# EAGLE design BLOCKS (EAGLE 9.6.2)
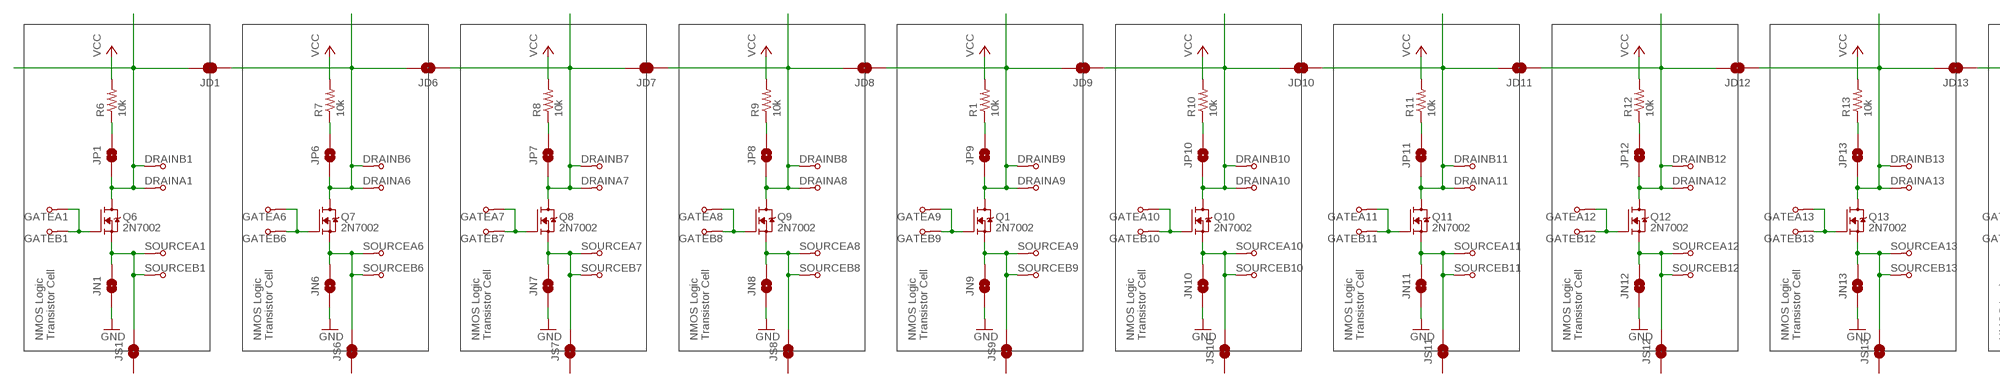
[diagram p0: schematic, sheet 1, part 1 of 2]
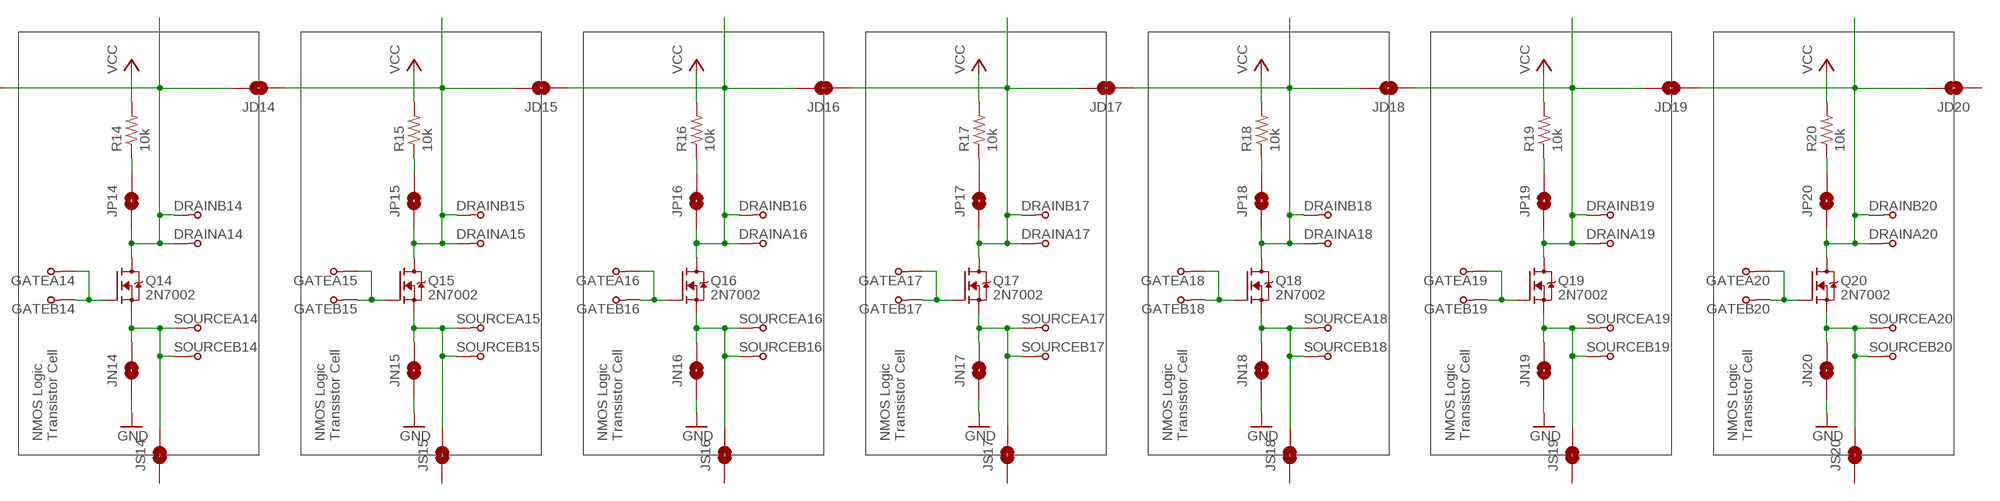
[diagram p1: schematic, sheet 1, part 2 of 2]

## Parts
DRAINA1  TPTHT  [PROTOPAD-THT-PAD]
DRAINA6  TPTHT  [PROTOPAD-THT-PAD]
DRAINA7  TPTHT  [PROTOPAD-THT-PAD]
DRAINA8  TPTHT  [PROTOPAD-THT-PAD]
DRAINA9  TPTHT  [PROTOPAD-THT-PAD]
DRAINA10  TPTHT  [PROTOPAD-THT-PAD]
DRAINA11  TPTHT  [PROTOPAD-THT-PAD]
DRAINA12  TPTHT  [PROTOPAD-THT-PAD]
DRAINA13  TPTHT  [PROTOPAD-THT-PAD]
DRAINA14  TPTHT  [PROTOPAD-THT-PAD]
DRAINA15  TPTHT  [PROTOPAD-THT-PAD]
DRAINA16  TPTHT  [PROTOPAD-THT-PAD]
DRAINA17  TPTHT  [PROTOPAD-THT-PAD]
DRAINA18  TPTHT  [PROTOPAD-THT-PAD]
DRAINA19  TPTHT  [PROTOPAD-THT-PAD]
DRAINA20  TPTHT  [PROTOPAD-THT-PAD]
DRAINB1  TPTHT  [PROTOPAD-THT-PAD]
DRAINB6  TPTHT  [PROTOPAD-THT-PAD]
DRAINB7  TPTHT  [PROTOPAD-THT-PAD]
DRAINB8  TPTHT  [PROTOPAD-THT-PAD]
DRAINB9  TPTHT  [PROTOPAD-THT-PAD]
DRAINB10  TPTHT  [PROTOPAD-THT-PAD]
DRAINB11  TPTHT  [PROTOPAD-THT-PAD]
DRAINB12  TPTHT  [PROTOPAD-THT-PAD]
DRAINB13  TPTHT  [PROTOPAD-THT-PAD]
DRAINB14  TPTHT  [PROTOPAD-THT-PAD]
DRAINB15  TPTHT  [PROTOPAD-THT-PAD]
DRAINB16  TPTHT  [PROTOPAD-THT-PAD]
DRAINB17  TPTHT  [PROTOPAD-THT-PAD]
DRAINB18  TPTHT  [PROTOPAD-THT-PAD]
DRAINB19  TPTHT  [PROTOPAD-THT-PAD]
DRAINB20  TPTHT  [PROTOPAD-THT-PAD]
GATEA1  TPTHT  [PROTOPAD-THT-PAD]
GATEA6  TPTHT  [PROTOPAD-THT-PAD]
GATEA7  TPTHT  [PROTOPAD-THT-PAD]
GATEA8  TPTHT  [PROTOPAD-THT-PAD]
GATEA9  TPTHT  [PROTOPAD-THT-PAD]
GATEA10  TPTHT  [PROTOPAD-THT-PAD]
GATEA11  TPTHT  [PROTOPAD-THT-PAD]
GATEA12  TPTHT  [PROTOPAD-THT-PAD]
GATEA13  TPTHT  [PROTOPAD-THT-PAD]
GATEA14  TPTHT  [PROTOPAD-THT-PAD]
GATEA15  TPTHT  [PROTOPAD-THT-PAD]
GATEA16  TPTHT  [PROTOPAD-THT-PAD]
GATEA17  TPTHT  [PROTOPAD-THT-PAD]
GATEA18  TPTHT  [PROTOPAD-THT-PAD]
GATEA19  TPTHT  [PROTOPAD-THT-PAD]
GATEA20  TPTHT  [PROTOPAD-THT-PAD]
GATEB1  TPTHT  [PROTOPAD-THT-PAD]
GATEB6  TPTHT  [PROTOPAD-THT-PAD]
GATEB7  TPTHT  [PROTOPAD-THT-PAD]
GATEB8  TPTHT  [PROTOPAD-THT-PAD]
GATEB9  TPTHT  [PROTOPAD-THT-PAD]
GATEB10  TPTHT  [PROTOPAD-THT-PAD]
GATEB11  TPTHT  [PROTOPAD-THT-PAD]
GATEB12  TPTHT  [PROTOPAD-THT-PAD]
GATEB13  TPTHT  [PROTOPAD-THT-PAD]
GATEB14  TPTHT  [PROTOPAD-THT-PAD]
GATEB15  TPTHT  [PROTOPAD-THT-PAD]
GATEB16  TPTHT  [PROTOPAD-THT-PAD]
GATEB17  TPTHT  [PROTOPAD-THT-PAD]
GATEB18  TPTHT  [PROTOPAD-THT-PAD]
GATEB19  TPTHT  [PROTOPAD-THT-PAD]
GATEB20  TPTHT  [PROTOPAD-THT-PAD]
JD1  SJ_NO_THIN  [SJ_2S-NO-THIN]
JD6  SJ_NO_THIN  [SJ_2S-NO-THIN]
JD7  SJ_NO_THIN  [SJ_2S-NO-THIN]
JD8  SJ_NO_THIN  [SJ_2S-NO-THIN]
JD9  SJ_NO_THIN  [SJ_2S-NO-THIN]
JD10  SJ_NO_THIN  [SJ_2S-NO-THIN]
JD11  SJ_NO_THIN  [SJ_2S-NO-THIN]
JD12  SJ_NO_THIN  [SJ_2S-NO-THIN]
JD13  SJ_NO_THIN  [SJ_2S-NO-THIN]
JD14  SJ_NO_THIN  [SJ_2S-NO-THIN]
JD15  SJ_NO_THIN  [SJ_2S-NO-THIN]
JD16  SJ_NO_THIN  [SJ_2S-NO-THIN]
JD17  SJ_NO_THIN  [SJ_2S-NO-THIN]
JD18  SJ_NO_THIN  [SJ_2S-NO-THIN]
JD19  SJ_NO_THIN  [SJ_2S-NO-THIN]
JD20  SJ_NO_THIN  [SJ_2S-NO-THIN]
JN1  SJ_NO_THIN  [SJ_2S-NO-THIN]
JN6  SJ_NO_THIN  [SJ_2S-NO-THIN]
JN7  SJ_NO_THIN  [SJ_2S-NO-THIN]
JN8  SJ_NO_THIN  [SJ_2S-NO-THIN]
JN9  SJ_NO_THIN  [SJ_2S-NO-THIN]
JN10  SJ_NO_THIN  [SJ_2S-NO-THIN]
JN11  SJ_NO_THIN  [SJ_2S-NO-THIN]
JN12  SJ_NO_THIN  [SJ_2S-NO-THIN]
JN13  SJ_NO_THIN  [SJ_2S-NO-THIN]
JN14  SJ_NO_THIN  [SJ_2S-NO-THIN]
JN15  SJ_NO_THIN  [SJ_2S-NO-THIN]
JN16  SJ_NO_THIN  [SJ_2S-NO-THIN]
JN17  SJ_NO_THIN  [SJ_2S-NO-THIN]
JN18  SJ_NO_THIN  [SJ_2S-NO-THIN]
JN19  SJ_NO_THIN  [SJ_2S-NO-THIN]
JN20  SJ_NO_THIN  [SJ_2S-NO-THIN]
JP1  SJ_NO_THIN  [SJ_2S-NO-THIN]
JP6  SJ_NO_THIN  [SJ_2S-NO-THIN]
JP7  SJ_NO_THIN  [SJ_2S-NO-THIN]
JP8  SJ_NO_THIN  [SJ_2S-NO-THIN]
JP9  SJ_NO_THIN  [SJ_2S-NO-THIN]
JP10  SJ_NO_THIN  [SJ_2S-NO-THIN]
JP11  SJ_NO_THIN  [SJ_2S-NO-THIN]
JP12  SJ_NO_THIN  [SJ_2S-NO-THIN]
JP13  SJ_NO_THIN  [SJ_2S-NO-THIN]
JP14  SJ_NO_THIN  [SJ_2S-NO-THIN]
JP15  SJ_NO_THIN  [SJ_2S-NO-THIN]
JP16  SJ_NO_THIN  [SJ_2S-NO-THIN]
JP17  SJ_NO_THIN  [SJ_2S-NO-THIN]
JP18  SJ_NO_THIN  [SJ_2S-NO-THIN]
JP19  SJ_NO_THIN  [SJ_2S-NO-THIN]
JP20  SJ_NO_THIN  [SJ_2S-NO-THIN]
JS1  SJ_NO_THIN  [SJ_2S-NO-THIN]
JS6  SJ_NO_THIN  [SJ_2S-NO-THIN]
JS7  SJ_NO_THIN  [SJ_2S-NO-THIN]
JS8  SJ_NO_THIN  [SJ_2S-NO-THIN]
JS9  SJ_NO_THIN  [SJ_2S-NO-THIN]
JS10  SJ_NO_THIN  [SJ_2S-NO-THIN]
JS11  SJ_NO_THIN  [SJ_2S-NO-THIN]
JS12  SJ_NO_THIN  [SJ_2S-NO-THIN]
JS13  SJ_NO_THIN  [SJ_2S-NO-THIN]
JS14  SJ_NO_THIN  [SJ_2S-NO-THIN]
JS15  SJ_NO_THIN  [SJ_2S-NO-THIN]
JS16  SJ_NO_THIN  [SJ_2S-NO-THIN]
JS17  SJ_NO_THIN  [SJ_2S-NO-THIN]
JS18  SJ_NO_THIN  [SJ_2S-NO-THIN]
JS19  SJ_NO_THIN  [SJ_2S-NO-THIN]
JS20  SJ_NO_THIN  [SJ_2S-NO-THIN]
Q1  2N7002  [SOT23]
Q6  2N7002  [SOT23]
Q7  2N7002  [SOT23]
Q8  2N7002  [SOT23]
Q9  2N7002  [SOT23]
Q10  2N7002  [SOT23]
Q11  2N7002  [SOT23]
Q12  2N7002  [SOT23]
Q13  2N7002  [SOT23]
Q14  2N7002  [SOT23]
Q15  2N7002  [SOT23]
Q16  2N7002  [SOT23]
Q17  2N7002  [SOT23]
Q18  2N7002  [SOT23]
Q19  2N7002  [SOT23]
Q20  2N7002  [SOT23]
R1  10k  RES0603  [R0603]
R6  10k  RES0603  [R0603]
R7  10k  RES0603  [R0603]
R8  10k  RES0603  [R0603]
R9  10k  RES0603  [R0603]
R10  10k  RES0603  [R0603]
R11  10k  RES0603  [R0603]
R12  10k  RES0603  [R0603]
R13  10k  RES0603  [R0603]
R14  10k  RES0603  [R0603]
R15  10k  RES0603  [R0603]
R16  10k  RES0603  [R0603]
R17  10k  RES0603  [R0603]
R18  10k  RES0603  [R0603]
R19  10k  RES0603  [R0603]
R20  10k  RES0603  [R0603]
SOURCEA1  TPTHT  [PROTOPAD-THT-PAD]
SOURCEA6  TPTHT  [PROTOPAD-THT-PAD]
SOURCEA7  TPTHT  [PROTOPAD-THT-PAD]
SOURCEA8  TPTHT  [PROTOPAD-THT-PAD]
SOURCEA9  TPTHT  [PROTOPAD-THT-PAD]
SOURCEA10  TPTHT  [PROTOPAD-THT-PAD]
SOURCEA11  TPTHT  [PROTOPAD-THT-PAD]
SOURCEA12  TPTHT  [PROTOPAD-THT-PAD]
SOURCEA13  TPTHT  [PROTOPAD-THT-PAD]
SOURCEA14  TPTHT  [PROTOPAD-THT-PAD]
SOURCEA15  TPTHT  [PROTOPAD-THT-PAD]
SOURCEA16  TPTHT  [PROTOPAD-THT-PAD]
SOURCEA17  TPTHT  [PROTOPAD-THT-PAD]
SOURCEA18  TPTHT  [PROTOPAD-THT-PAD]
SOURCEA19  TPTHT  [PROTOPAD-THT-PAD]
SOURCEA20  TPTHT  [PROTOPAD-THT-PAD]
SOURCEB1  TPTHT  [PROTOPAD-THT-PAD]
SOURCEB6  TPTHT  [PROTOPAD-THT-PAD]
SOURCEB7  TPTHT  [PROTOPAD-THT-PAD]
SOURCEB8  TPTHT  [PROTOPAD-THT-PAD]
SOURCEB9  TPTHT  [PROTOPAD-THT-PAD]
SOURCEB10  TPTHT  [PROTOPAD-THT-PAD]
SOURCEB11  TPTHT  [PROTOPAD-THT-PAD]
SOURCEB12  TPTHT  [PROTOPAD-THT-PAD]
SOURCEB13  TPTHT  [PROTOPAD-THT-PAD]
SOURCEB14  TPTHT  [PROTOPAD-THT-PAD]
SOURCEB15  TPTHT  [PROTOPAD-THT-PAD]
SOURCEB16  TPTHT  [PROTOPAD-THT-PAD]
SOURCEB17  TPTHT  [PROTOPAD-THT-PAD]
SOURCEB18  TPTHT  [PROTOPAD-THT-PAD]
SOURCEB19  TPTHT  [PROTOPAD-THT-PAD]
SOURCEB20  TPTHT  [PROTOPAD-THT-PAD]

## Nets
GND: JN1.1 JN6.1 JN7.1 JN8.1 JN9.1 JN10.1 JN11.1 JN12.1 JN13.1 JN14.1 JN15.1 JN16.1 JN17.1 JN18.1 JN19.1 JN20.1
N$1: JP9.2 R1.1
N$2: JN9.2 JS9.2 Q1.2(S) SOURCEA9.P1(S) SOURCEB9.P1(S)
N$5: DRAINA9.P1(S) DRAINB9.P1(S) JD8.1 JD9.2 JP9.1 Q1.3(D)
N$7: JP1.2 R6.1
N$21: JN1.2 JS1.2 Q6.2(S) SOURCEA1.P1(S) SOURCEB1.P1(S)
N$22: DRAINA1.P1(S) DRAINB1.P1(S) JD1.2 JP1.1 Q6.3(D)
N$23: GATEA1.P1(S) GATEB1.P1(S) Q6.1(G)
N$24: JP6.2 R7.1
N$25: JN6.2 JS6.2 Q7.2(S) SOURCEA6.P1(S) SOURCEB6.P1(S)
N$26: DRAINA6.P1(S) DRAINB6.P1(S) JD1.1 JD6.2 JP6.1 Q7.3(D)
N$27: GATEA6.P1(S) GATEB6.P1(S) Q7.1(G)
N$28: JP7.2 R8.1
N$29: JN7.2 JS7.2 Q8.2(S) SOURCEA7.P1(S) SOURCEB7.P1(S)
N$30: DRAINA7.P1(S) DRAINB7.P1(S) JD6.1 JD7.2 JP7.1 Q8.3(D)
N$31: GATEA7.P1(S) GATEB7.P1(S) Q8.1(G)
N$32: JP8.2 R9.1
N$33: JN8.2 JS8.2 Q9.2(S) SOURCEA8.P1(S) SOURCEB8.P1(S)
N$34: DRAINA8.P1(S) DRAINB8.P1(S) JD7.1 JD8.2 JP8.1 Q9.3(D)
N$35: GATEA8.P1(S) GATEB8.P1(S) Q9.1(G)
N$36: GATEA9.P1(S) GATEB9.P1(S) Q1.1(G)
N$37: JP10.2 R10.1
N$38: JN10.2 JS10.2 Q10.2(S) SOURCEA10.P1(S) SOURCEB10.P1(S)
N$39: DRAINA10.P1(S) DRAINB10.P1(S) JD9.1 JD10.2 JP10.1 Q10.3(D)
N$40: GATEA10.P1(S) GATEB10.P1(S) Q10.1(G)
N$41: JP11.2 R11.1
N$42: JN11.2 JS11.2 Q11.2(S) SOURCEA11.P1(S) SOURCEB11.P1(S)
N$43: DRAINA11.P1(S) DRAINB11.P1(S) JD10.1 JD11.2 JP11.1 Q11.3(D)
N$44: GATEA11.P1(S) GATEB11.P1(S) Q11.1(G)
N$45: JP12.2 R12.1
N$46: JN12.2 JS12.2 Q12.2(S) SOURCEA12.P1(S) SOURCEB12.P1(S)
N$47: DRAINA12.P1(S) DRAINB12.P1(S) JD11.1 JD12.2 JP12.1 Q12.3(D)
N$48: GATEA12.P1(S) GATEB12.P1(S) Q12.1(G)
N$49: JP13.2 R13.1
N$50: JN13.2 JS13.2 Q13.2(S) SOURCEA13.P1(S) SOURCEB13.P1(S)
N$51: DRAINA13.P1(S) DRAINB13.P1(S) JD12.1 JD13.2 JP13.1 Q13.3(D)
N$52: GATEA13.P1(S) GATEB13.P1(S) Q13.1(G)
N$53: JP14.2 R14.1
N$54: JN14.2 JS14.2 Q14.2(S) SOURCEA14.P1(S) SOURCEB14.P1(S)
N$55: DRAINA14.P1(S) DRAINB14.P1(S) JD13.1 JD14.2 JP14.1 Q14.3(D)
N$56: GATEA14.P1(S) GATEB14.P1(S) Q14.1(G)
N$57: JP15.2 R15.1
N$58: JN15.2 JS15.2 Q15.2(S) SOURCEA15.P1(S) SOURCEB15.P1(S)
N$59: DRAINA15.P1(S) DRAINB15.P1(S) JD14.1 JD15.2 JP15.1 Q15.3(D)
N$60: GATEA15.P1(S) GATEB15.P1(S) Q15.1(G)
N$61: JP16.2 R16.1
N$62: JN16.2 JS16.2 Q16.2(S) SOURCEA16.P1(S) SOURCEB16.P1(S)
N$63: DRAINA16.P1(S) DRAINB16.P1(S) JD15.1 JD16.2 JP16.1 Q16.3(D)
N$64: GATEA16.P1(S) GATEB16.P1(S) Q16.1(G)
N$65: JP17.2 R17.1
N$66: JN17.2 JS17.2 Q17.2(S) SOURCEA17.P1(S) SOURCEB17.P1(S)
N$67: DRAINA17.P1(S) DRAINB17.P1(S) JD16.1 JD17.2 JP17.1 Q17.3(D)
N$68: GATEA17.P1(S) GATEB17.P1(S) Q17.1(G)
N$69: JP18.2 R18.1
N$70: JN18.2 JS18.2 Q18.2(S) SOURCEA18.P1(S) SOURCEB18.P1(S)
N$71: DRAINA18.P1(S) DRAINB18.P1(S) JD17.1 JD18.2 JP18.1 Q18.3(D)
N$72: GATEA18.P1(S) GATEB18.P1(S) Q18.1(G)
N$73: JP19.2 R19.1
N$74: JN19.2 JS19.2 Q19.2(S) SOURCEA19.P1(S) SOURCEB19.P1(S)
N$75: DRAINA19.P1(S) DRAINB19.P1(S) JD18.1 JD19.2 JP19.1 Q19.3(D)
N$76: GATEA19.P1(S) GATEB19.P1(S) Q19.1(G)
N$77: JP20.2 R20.1
N$78: JN20.2 JS20.2 Q20.2(S) SOURCEA20.P1(S) SOURCEB20.P1(S)
N$79: DRAINA20.P1(S) DRAINB20.P1(S) JD19.1 JD20.2 JP20.1 Q20.3(D)
N$80: GATEA20.P1(S) GATEB20.P1(S) Q20.1(G)
VCC: R1.2 R6.2 R7.2 R8.2 R9.2 R10.2 R11.2 R12.2 R13.2 R14.2 R15.2 R16.2 R17.2 R18.2 R19.2 R20.2
Unconnected: JD20.1 JS1.1 JS6.1 JS7.1 JS8.1 JS9.1 JS10.1 JS11.1 JS12.1 JS13.1 JS14.1 JS15.1 JS16.1 JS17.1 JS18.1 JS19.1 JS20.1

## Notes on the sheet
- NMOS Logic
  Transistor Cell
- NMOS Logic
  Transistor Cell
- NMOS Logic
  Transistor Cell
- NMOS Logic
  Transistor Cell
- NMOS Logic
  Transistor Cell
- NMOS Logic
  Transistor Cell
- NMOS Logic
  Transistor Cell
- NMOS Logic
  Transistor Cell
- NMOS Logic
  Transistor Cell
- NMOS Logic
  Transistor Cell
- NMOS Logic
  Transistor Cell
- NMOS Logic
  Transistor Cell
- NMOS Logic
  Transistor Cell
- NMOS Logic
  Transistor Cell
- NMOS Logic
  Transistor Cell
- NMOS Logic
  Transistor Cell

## Library data of the parts
DRAINA1 DRAINA6-DRAINA20 DRAINB1 DRAINB6-DRAINB20 GATEA1 GATEA6-GATEA20 GATEB1 GATEB6-GATEB20 SOURCEA1 SOURCEA6-SOURCEA20 SOURCEB1 SOURCEB6-SOURCEB20 = ellajameson-core:TP
JD1 JD6-JD20 JN1 JN6-JN20 JP1 JP6-JP20 JS1 JS6-JS20 = ellajameson-core:SJ: Solder Jumper Standard SMD solder jumper. Used to automate production. Two varients : Normally Open and Normally Closed are the same, but have different paste layers. NC will have a large amount of paste and should jumper during reflow.
Q1 Q6-Q20 = ellajameson-core:2N7002
R1 R6-R20 = ellajameson-core:RES

## Board
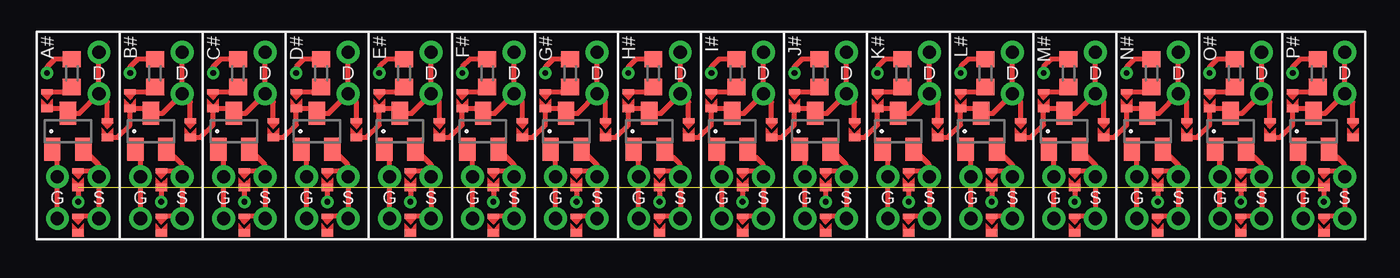
[diagram p2: board, top side]
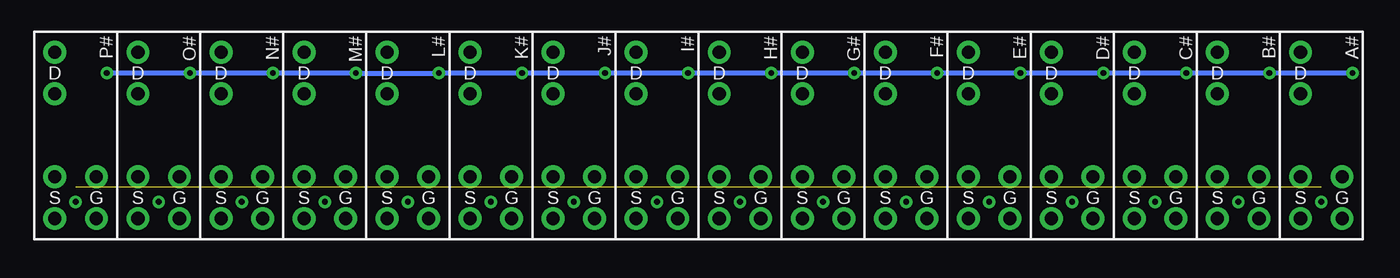
[diagram p3: board, bottom side, seen from below]

No outline drawn. Coordinates in mm, seen from the top.
Copper layers (1*16): Top 0.035mm / dielectric 1.5mm / Bottom 0.035mm
Design rules "default": minimum track width 6mil, minimum drill 0.35mm, track to track 6mil, track to pad 6mil, pad to pad 6mil, via to via 6mil, smd to smd 6mil, copper to edge 40mil, drill to drill 6mil, minimum pad ring 10mil, minimum via ring 8mil, stop-mask expansion 4mil, vias tented up to drill 0mil, thermal gap 10mil

### Footprints (pad centres in the part's own frame; a part is rotated, then mirrored left to right if it is on the bottom)
PROTOPAD-THT-PAD = drill 0.8 pad 1.4: P1 0,0
SJ_2S-NO-THIN = smd 0.45 x 0.7: 1 -0.508,0 | smd 0.3 x 0.7: 2 0.508,0
SOT23 = smd 1 x 1.4: 1 -0.95,-1.1; 2 0.95,-1.1; 3 0,1.1
R0603 = smd 1 x 1.1: 1 -0.85,0; 2 0.85,0

### Placement (x,y rotation side)
DRAINA1  3.81,11.43 0 top
DRAINA6  8.89,11.43 0 top
DRAINA7  13.97,11.43 0 top
DRAINA8  19.05,11.43 0 top
DRAINA9  24.13,11.43 0 top
DRAINA10  29.21,11.43 0 top
DRAINA11  34.29,11.43 0 top
DRAINA12  39.37,11.43 0 top
DRAINA13  44.45,11.43 0 top
DRAINA14  49.53,11.43 0 top
DRAINA15  54.61,11.43 0 top
DRAINA16  59.69,11.43 0 top
DRAINA17  64.77,11.43 0 top
DRAINA18  69.85,11.43 0 top
DRAINA19  74.93,11.43 0 top
DRAINA20  80.01,11.43 0 top
DRAINB1  3.81,8.89 0 top
DRAINB6  8.89,8.89 0 top
DRAINB7  13.97,8.89 0 top
DRAINB8  19.05,8.89 0 top
DRAINB9  24.13,8.89 0 top
DRAINB10  29.21,8.89 0 top
DRAINB11  34.29,8.89 0 top
DRAINB12  39.37,8.89 0 top
DRAINB13  44.45,8.89 0 top
DRAINB14  49.53,8.89 0 top
DRAINB15  54.61,8.89 0 top
DRAINB16  59.69,8.89 0 top
DRAINB17  64.77,8.89 0 top
DRAINB18  69.85,8.89 0 top
DRAINB19  74.93,8.89 0 top
DRAINB20  80.01,8.89 0 top
GATEA1  1.27,3.81 0 top
GATEA6  6.35,3.81 0 top
GATEA7  11.43,3.81 0 top
GATEA8  16.51,3.81 0 top
GATEA9  21.59,3.81 0 top
GATEA10  26.67,3.81 0 top
GATEA11  31.75,3.81 0 top
GATEA12  36.83,3.81 0 top
GATEA13  41.91,3.81 0 top
GATEA14  46.99,3.81 0 top
GATEA15  52.07,3.81 0 top
GATEA16  57.15,3.81 0 top
GATEA17  62.23,3.81 0 top
GATEA18  67.31,3.81 0 top
GATEA19  72.39,3.81 0 top
GATEA20  77.47,3.81 0 top
GATEB1  1.27,1.27 0 top
GATEB6  6.35,1.27 0 top
GATEB7  11.43,1.27 0 top
GATEB8  16.51,1.27 0 top
GATEB9  21.59,1.27 0 top
GATEB10  26.67,1.27 0 top
GATEB11  31.75,1.27 0 top
GATEB12  36.83,1.27 0 top
GATEB13  41.91,1.27 0 top
GATEB14  46.99,1.27 0 top
GATEB15  52.07,1.27 0 top
GATEB16  57.15,1.27 0 top
GATEB17  62.23,1.27 0 top
GATEB18  67.31,1.27 0 top
GATEB19  72.39,1.27 0 top
GATEB20  77.47,1.27 0 top
JD1  4.32,6.73 90 top
JD6  9.4,6.73 90 top
JD7  14.48,6.73 90 top
JD8  19.56,6.73 90 top
JD9  24.64,6.73 90 top
JD10  29.72,6.73 90 top
JD11  34.8,6.73 90 top
JD12  39.88,6.73 90 top
JD13  44.96,6.73 90 top
JD14  50.04,6.73 90 top
JD15  55.12,6.73 90 top
JD16  60.2,6.73 90 top
JD17  65.28,6.73 90 top
JD18  70.36,6.73 90 top
JD19  75.44,6.73 90 top
JD20  80.52,6.73 90 top
JN1  2.54,3.68 90 top
JN6  7.62,3.68 90 top
JN7  12.7,3.68 90 top
JN8  17.78,3.68 90 top
JN9  22.86,3.68 90 top
JN10  27.94,3.68 90 top
JN11  33.02,3.68 90 top
JN12  38.1,3.68 90 top
JN13  43.18,3.68 90 top
JN14  48.26,3.68 90 top
JN15  53.34,3.68 90 top
JN16  58.42,3.68 90 top
JN17  63.5,3.68 90 top
JN18  68.58,3.68 90 top
JN19  73.66,3.68 90 top
JN20  78.74,3.68 90 top
JP1  0.64,8.51 90 top
JP6  5.71,8.51 90 top
JP7  10.79,8.51 90 top
JP8  15.88,8.51 90 top
JP9  20.95,8.51 90 top
JP10  26.04,8.51 90 top
JP11  31.11,8.51 90 top
JP12  36.2,8.51 90 top
JP13  41.27,8.51 90 top
JP14  46.35,8.51 90 top
JP15  51.44,8.51 90 top
JP16  56.52,8.51 90 top
JP17  61.59,8.51 90 top
JP18  66.67,8.51 90 top
JP19  71.75,8.51 90 top
JP20  76.83,8.51 90 top
JS1  2.54,0.89 90 top
JS6  7.62,0.89 90 top
JS7  12.7,0.89 90 top
JS8  17.78,0.89 90 top
JS9  22.86,0.89 90 top
JS10  27.94,0.89 90 top
JS11  33.02,0.89 90 top
JS12  38.1,0.89 90 top
JS13  43.18,0.89 90 top
JS14  48.26,0.89 90 top
JS15  53.34,0.89 90 top
JS16  58.42,0.89 90 top
JS17  63.5,0.89 90 top
JS18  68.58,0.89 90 top
JS19  73.66,0.89 90 top
JS20  78.74,0.89 90 top
Q1  22.23,6.6 0 top
Q6  1.91,6.6 0 top
Q7  6.99,6.6 0 top
Q8  12.06,6.6 0 top
Q9  17.14,6.6 0 top
Q10  27.3,6.6 0 top
Q11  32.38,6.6 0 top
Q12  37.47,6.6 0 top
Q13  42.55,6.6 0 top
Q14  47.62,6.6 0 top
Q15  52.7,6.6 0 top
Q16  57.78,6.6 0 top
Q17  62.87,6.6 0 top
Q18  67.94,6.6 0 top
Q19  73.03,6.6 0 top
Q20  78.11,6.6 0 top
R1  22.48,10.16 90 top
R6  2.16,10.16 90 top
R7  7.24,10.16 90 top
R8  12.32,10.16 90 top
R9  17.4,10.16 90 top
R10  27.56,10.16 90 top
R11  32.64,10.16 90 top
R12  37.72,10.16 90 top
R13  42.8,10.16 90 top
R14  47.88,10.16 90 top
R15  52.96,10.16 90 top
R16  58.04,10.16 90 top
R17  63.12,10.16 90 top
R18  68.2,10.16 90 top
R19  73.28,10.16 90 top
R20  78.36,10.16 90 top
SOURCEA1  3.81,3.81 0 top
SOURCEA6  8.89,3.81 0 top
SOURCEA7  13.97,3.81 0 top
SOURCEA8  19.05,3.81 0 top
SOURCEA9  24.13,3.81 0 top
SOURCEA10  29.21,3.81 0 top
SOURCEA11  34.29,3.81 0 top
SOURCEA12  39.37,3.81 0 top
SOURCEA13  44.45,3.81 0 top
SOURCEA14  49.53,3.81 0 top
SOURCEA15  54.61,3.81 0 top
SOURCEA16  59.69,3.81 0 top
SOURCEA17  64.77,3.81 0 top
SOURCEA18  69.85,3.81 0 top
SOURCEA19  74.93,3.81 0 top
SOURCEA20  80.01,3.81 0 top
SOURCEB1  3.81,1.27 0 top
SOURCEB6  8.89,1.27 0 top
SOURCEB7  13.97,1.27 0 top
SOURCEB8  19.05,1.27 0 top
SOURCEB9  24.13,1.27 0 top
SOURCEB10  29.21,1.27 0 top
SOURCEB11  34.29,1.27 0 top
SOURCEB12  39.37,1.27 0 top
SOURCEB13  44.45,1.27 0 top
SOURCEB14  49.53,1.27 0 top
SOURCEB15  54.61,1.27 0 top
SOURCEB16  59.69,1.27 0 top
SOURCEB17  64.77,1.27 0 top
SOURCEB18  69.85,1.27 0 top
SOURCEB19  74.93,1.27 0 top
SOURCEB20  80.01,1.27 0 top

### Tracks (layer width: path | path; a pad name or v marks a point on that pad's centre or on a via)
GND  (via drill 0.35)  (15 unrouted)
  Top 0.305: JN1.1 v2.54,2.29 | JN6.1 v7.62,2.29 | JN7.1 v12.7,2.29 | JN8.1 v17.78,2.29 | JN9.1 v22.86,2.29 | JN10.1 v27.94,2.29 | JN11.1 v33.02,2.29 | JN12.1 v38.1,2.29 | JN13.1 v43.18,2.29 | JN14.1 v48.26,2.29 | JN15.1 v53.34,2.29 | JN16.1 v58.42,2.29 | JN17.1 v63.5,2.29 | JN18.1 v68.58,2.29 | JN19.1 v73.66,2.29 | JN20.1 v78.74,2.29
N$1
  Top 0.305: JP9.2 22.19,9.02 R1.1
N$2
  Top 0.305: SOURCEA9.P1 SOURCEB9.P1 24,1.4 JS9.2 | SOURCEA9.P1 24.13,4.55 Q1.2 | JN9.2 23.75,4.19 SOURCEA9.P1
N$5
  Top 0.305: DRAINB9.P1 DRAINA9.P1 | DRAINB9.P1 22.94,7.7 Q1.3 21.93,8 JP9.1 20.95,6.99 20.19,6.22 JD8.1 | JD9.2 24.64,8.38 DRAINB9.P1
N$7
  Top 0.305: JP1.2 1.87,9.02 R6.1
N$21
  Top 0.305: SOURCEA1.P1 SOURCEB1.P1 3.68,1.4 JS1.2 | SOURCEA1.P1 3.81,4.55 Q6.2 | JN1.2 3.43,4.19 SOURCEA1.P1
N$22
  Top 0.305: DRAINB1.P1 DRAINA1.P1 | JP1.1 1.61,8 Q6.3 2.62,7.7 DRAINB1.P1 | JD1.2 4.32,8.38 DRAINB1.P1
N$23
  Top 0.305: GATEB1.P1 GATEA1.P1 1.27,5.19 Q6.1
N$24
  Top 0.305: JP6.2 6.95,9.02 R7.1
N$25
  Top 0.305: SOURCEA6.P1 SOURCEB6.P1 8.76,1.4 JS6.2 | SOURCEA6.P1 8.89,4.55 Q7.2 | JN6.2 8.51,4.19 SOURCEA6.P1
N$26
  Top 0.305: DRAINB6.P1 DRAINA6.P1 | DRAINB6.P1 7.7,7.7 Q7.3 6.69,8 JP6.1 5.71,6.99 4.95,6.22 JD1.1 | JD6.2 9.4,8.38 DRAINB6.P1
N$27
  Top 0.305: GATEB6.P1 GATEA6.P1 6.35,5.19 Q7.1
N$28
  Top 0.305: JP7.2 12.03,9.02 R8.1
N$29
  Top 0.305: SOURCEA7.P1 SOURCEB7.P1 13.84,1.4 JS7.2 | SOURCEA7.P1 13.97,4.55 Q8.2 | JN7.2 13.59,4.19 SOURCEA7.P1
N$30
  Top 0.305: DRAINB7.P1 DRAINA7.P1 | DRAINB7.P1 12.78,7.7 Q8.3 11.77,8 JP7.1 10.79,6.99 10.03,6.22 JD6.1 | JD7.2 14.48,8.38 DRAINB7.P1
N$31
  Top 0.305: GATEB7.P1 GATEA7.P1 11.43,5.19 Q8.1
N$32
  Top 0.305: JP8.2 17.11,9.02 R9.1
N$33
  Top 0.305: SOURCEA8.P1 SOURCEB8.P1 18.92,1.4 JS8.2 | SOURCEA8.P1 19.05,4.55 Q9.2 | JN8.2 18.67,4.19 SOURCEA8.P1
N$34
  Top 0.305: DRAINB8.P1 DRAINA8.P1 | DRAINB8.P1 17.86,7.7 Q9.3 16.85,8 JP8.1 15.88,6.99 15.11,6.22 JD7.1 | JD8.2 19.56,8.38 DRAINB8.P1
N$35
  Top 0.305: GATEB8.P1 GATEA8.P1 16.51,5.19 Q9.1
N$36
  Top 0.305: GATEB9.P1 GATEA9.P1 21.59,5.19 Q1.1
N$37
  Top 0.305: JP10.2 27.27,9.02 R10.1
N$38
  Top 0.305: SOURCEA10.P1 SOURCEB10.P1 29.08,1.4 JS10.2 | SOURCEA10.P1 29.21,4.55 Q10.2 | JN10.2 28.83,4.19 SOURCEA10.P1
N$39
  Top 0.305: DRAINB10.P1 DRAINA10.P1 | DRAINB10.P1 28.02,7.7 Q10.3 27.01,8 JP10.1 26.04,6.99 25.27,6.22 JD9.1 | JD10.2 29.72,8.38 DRAINB10.P1
N$40
  Top 0.305: GATEB10.P1 GATEA10.P1 26.67,5.19 Q10.1
N$41
  Top 0.305: JP11.2 32.35,9.02 R11.1
N$42
  Top 0.305: SOURCEA11.P1 SOURCEB11.P1 34.16,1.4 JS11.2 | SOURCEA11.P1 34.29,4.55 Q11.2 | JN11.2 33.91,4.19 SOURCEA11.P1
N$43
  Top 0.305: DRAINB11.P1 DRAINA11.P1 | DRAINB11.P1 33.1,7.7 Q11.3 32.09,8 JP11.1 31.11,6.99 30.35,6.22 JD10.1 | JD11.2 34.8,8.38 DRAINB11.P1
N$44
  Top 0.305: GATEB11.P1 GATEA11.P1 31.75,5.19 Q11.1
N$45
  Top 0.305: JP12.2 37.43,9.02 R12.1
N$46
  Top 0.305: SOURCEA12.P1 SOURCEB12.P1 39.24,1.4 JS12.2 | SOURCEA12.P1 39.37,4.55 Q12.2 | JN12.2 38.99,4.19 SOURCEA12.P1
N$47
  Top 0.305: DRAINB12.P1 DRAINA12.P1 | DRAINB12.P1 38.18,7.7 Q12.3 37.17,8 JP12.1 36.2,6.99 35.43,6.22 JD11.1 | JD12.2 39.88,8.38 DRAINB12.P1
N$48
  Top 0.305: GATEB12.P1 GATEA12.P1 36.83,5.19 Q12.1
N$49
  Top 0.305: JP13.2 42.51,9.02 R13.1
N$50
  Top 0.305: SOURCEA13.P1 SOURCEB13.P1 44.32,1.4 JS13.2 | SOURCEA13.P1 44.45,4.55 Q13.2 | JN13.2 44.07,4.19 SOURCEA13.P1
N$51
  Top 0.305: DRAINB13.P1 DRAINA13.P1 | DRAINB13.P1 43.26,7.7 Q13.3 42.25,8 JP13.1 41.27,6.99 40.51,6.22 JD12.1 | JD13.2 44.96,8.38 DRAINB13.P1
N$52
  Top 0.305: GATEB13.P1 GATEA13.P1 41.91,5.19 Q13.1
N$53
  Top 0.305: JP14.2 47.59,9.02 R14.1
N$54
  Top 0.305: SOURCEA14.P1 SOURCEB14.P1 49.4,1.4 JS14.2 | SOURCEA14.P1 49.53,4.55 Q14.2 | JN14.2 49.15,4.19 SOURCEA14.P1
N$55
  Top 0.305: DRAINB14.P1 DRAINA14.P1 | DRAINB14.P1 48.34,7.7 Q14.3 47.33,8 JP14.1 46.35,6.99 45.59,6.22 JD13.1 | JD14.2 50.04,8.38 DRAINB14.P1
N$56
  Top 0.305: GATEB14.P1 GATEA14.P1 46.99,5.19 Q14.1
N$57
  Top 0.305: JP15.2 52.67,9.02 R15.1
N$58
  Top 0.305: SOURCEA15.P1 SOURCEB15.P1 54.48,1.4 JS15.2 | SOURCEA15.P1 54.61,4.55 Q15.2 | JN15.2 54.23,4.19 SOURCEA15.P1
N$59
  Top 0.305: DRAINB15.P1 DRAINA15.P1 | DRAINB15.P1 53.42,7.7 Q15.3 52.41,8 JP15.1 51.44,6.99 50.67,6.22 JD14.1 | JD15.2 55.12,8.38 DRAINB15.P1
N$60
  Top 0.305: GATEB15.P1 GATEA15.P1 52.07,5.19 Q15.1
N$61
  Top 0.305: JP16.2 57.75,9.02 R16.1
N$62
  Top 0.305: SOURCEA16.P1 SOURCEB16.P1 59.56,1.4 JS16.2 | SOURCEA16.P1 59.69,4.55 Q16.2 | JN16.2 59.31,4.19 SOURCEA16.P1
N$63
  Top 0.305: DRAINB16.P1 DRAINA16.P1 | DRAINB16.P1 58.5,7.7 Q16.3 57.49,8 JP16.1 56.52,6.99 55.75,6.22 JD15.1 | JD16.2 60.2,8.38 DRAINB16.P1
N$64
  Top 0.305: GATEB16.P1 GATEA16.P1 57.15,5.19 Q16.1
N$65
  Top 0.305: JP17.2 62.83,9.02 R17.1
N$66
  Top 0.305: SOURCEA17.P1 SOURCEB17.P1 64.64,1.4 JS17.2 | SOURCEA17.P1 64.77,4.55 Q17.2 | JN17.2 64.39,4.19 SOURCEA17.P1
N$67
  Top 0.305: DRAINB17.P1 DRAINA17.P1 | DRAINB17.P1 63.58,7.7 Q17.3 62.57,8 JP17.1 61.59,6.99 60.83,6.22 JD16.1 | JD17.2 65.28,8.38 DRAINB17.P1
N$68
  Top 0.305: GATEB17.P1 GATEA17.P1 62.23,5.19 Q17.1
N$69
  Top 0.305: JP18.2 67.91,9.02 R18.1
N$70
  Top 0.305: SOURCEA18.P1 SOURCEB18.P1 69.72,1.4 JS18.2 | SOURCEA18.P1 69.85,4.55 Q18.2 | JN18.2 69.47,4.19 SOURCEA18.P1
N$71
  Top 0.305: DRAINB18.P1 DRAINA18.P1 | DRAINB18.P1 68.66,7.7 Q18.3 67.65,8 JP18.1 66.67,6.99 65.91,6.22 JD17.1 | JD18.2 70.36,8.38 DRAINB18.P1
N$72
  Top 0.305: GATEB18.P1 GATEA18.P1 67.31,5.19 Q18.1
N$73
  Top 0.305: JP19.2 72.99,9.02 R19.1
N$74
  Top 0.305: SOURCEA19.P1 SOURCEB19.P1 74.8,1.4 JS19.2 | SOURCEA19.P1 74.93,4.55 Q19.2 | JN19.2 74.55,4.19 SOURCEA19.P1
N$75
  Top 0.305: DRAINB19.P1 DRAINA19.P1 | DRAINB19.P1 73.74,7.7 Q19.3 72.73,8 JP19.1 71.75,6.99 70.99,6.22 JD18.1 | JD19.2 75.44,8.38 DRAINB19.P1
N$76
  Top 0.305: GATEB19.P1 GATEA19.P1 72.39,5.19 Q19.1
N$77
  Top 0.305: JP20.2 78.07,9.02 R20.1
N$78
  Top 0.305: SOURCEA20.P1 SOURCEB20.P1 79.88,1.4 JS20.2 | SOURCEA20.P1 80.01,4.55 Q20.2 | JN20.2 79.63,4.19 SOURCEA20.P1
N$79
  Top 0.305: DRAINB20.P1 DRAINA20.P1 | DRAINB20.P1 78.82,7.7 Q20.3 77.81,8 JP20.1 76.83,6.99 76.07,6.22 JD19.1 | JD20.2 80.52,8.38 DRAINB20.P1
N$80
  Top 0.305: GATEB20.P1 GATEA20.P1 77.47,5.19 Q20.1
VCC  (via drill 0.35)
  Top 0.305: R6.2 1.1,11.01 0.64,10.54 v0.64,10.16 | R7.2 6.18,11.01 5.71,10.54 v5.71,10.16 | R8.2 11.26,11.01 10.79,10.54 v10.79,10.16 | R9.2 16.34,11.01 15.88,10.54 v15.88,10.16 | R1.2 21.42,11.01 20.95,10.54 v20.95,10.16 | R10.2 26.5,11.01 26.04,10.54 v26.04,10.16 | R11.2 31.58,11.01 31.11,10.54 v31.11,10.16 | R12.2 36.66,11.01 36.2,10.54 v36.2,10.16 | R13.2 41.74,11.01 41.27,10.54 v41.27,10.16 | R14.2 46.82,11.01 46.35,10.54 v46.35,10.16 | R15.2 51.9,11.01 51.44,10.54 v51.44,10.16 | R16.2 56.98,11.01 56.52,10.54 v56.52,10.16 | R17.2 62.06,11.01 61.59,10.54 v61.59,10.16 | R18.2 67.14,11.01 66.67,10.54 v66.67,10.16 | R19.2 72.22,11.01 71.75,10.54 v71.75,10.16 | R20.2 77.3,11.01 76.83,10.54 v76.83,10.16
  Bottom 0.305: v0.64,10.16 v5.71,10.16 v10.79,10.16 v15.88,10.16 v20.95,10.16 v26.04,10.16 v31.11,10.16 v36.2,10.16 v41.27,10.16 v46.35,10.16 v51.44,10.16 v56.52,10.16 v61.59,10.16 v66.67,10.16 v71.75,10.16 v76.83,10.16

### Text on the board
tPlace: A# | B# | C# | D# | E# | F# | G# | H# | I# | J# | K# | L# | M# | N# | O# | P# | D | D | D | D | D | D | D | D | D | D | D | D | D | D | D | D | G | S | G | S | G | S | G | S | G | S | G | S | G | S | G | S | G | S | G | S | G | S | G | S | G | S | G | S | G | S | G | S
bPlace: A# | B# | C# | D# | E# | F# | G# | H# | I# | J# | K# | L# | M# | N# | O# | P# | D | D | D | D | D | D | D | D | D | D | D | D | D | D | D | D | G | S | G | S | G | S | G | S | G | S | G | S | G | S | G | S | G | S | G | S | G | S | G | S | G | S | G | S | G | S | G | S